# EAGLE design Adafruit Perma Proto Pi - Full Size (EAGLE 6.4)
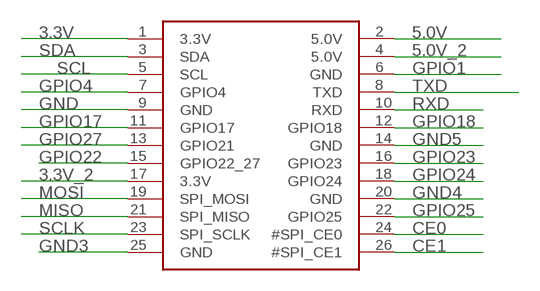
[diagram p0: schematic, sheet 1]

## Parts
JP1  RASBERRYPI_IDC  [RASBERRYPI_IDC]

## Nets
3.3V: JP1.1(3.3V)
3.3V_2: JP1.17(3.3V)
5.0V: JP1.2(5.0V)
5.0V_2: JP1.4(5.0V)
CE0: JP1.24(#SPI_CE0)
CE1: JP1.26(#SPI_CE1)
GND: JP1.9(GND)
GND3: JP1.25(GND)
GND4: JP1.20(GND)
GND5: JP1.14(GND)
GPIO1: JP1.6(GND)
GPIO4: JP1.7(GPIO4)
GPIO17: JP1.11(GPIO17)
GPIO18: JP1.12(GPIO18)
GPIO22: JP1.15(GPIO22_27)
GPIO23: JP1.16(GPIO23)
GPIO24: JP1.18(GPIO24)
GPIO25: JP1.22(GPIO25)
GPIO27: JP1.13(GPIO21)
MISO: JP1.21(SPI_MISO)
MOSI: JP1.19(SPI_MOSI)
RXD: JP1.10(RXD)
SCL: JP1.5(SCL)
SCLK: JP1.23(SPI_SCLK)
SDA: JP1.3(SDA)
TXD: JP1.8(TXD)

## Library data of the parts
JP1 = microbuilder:RASBERRYPI_IDC: Rasberry PI IDC Header

## Board
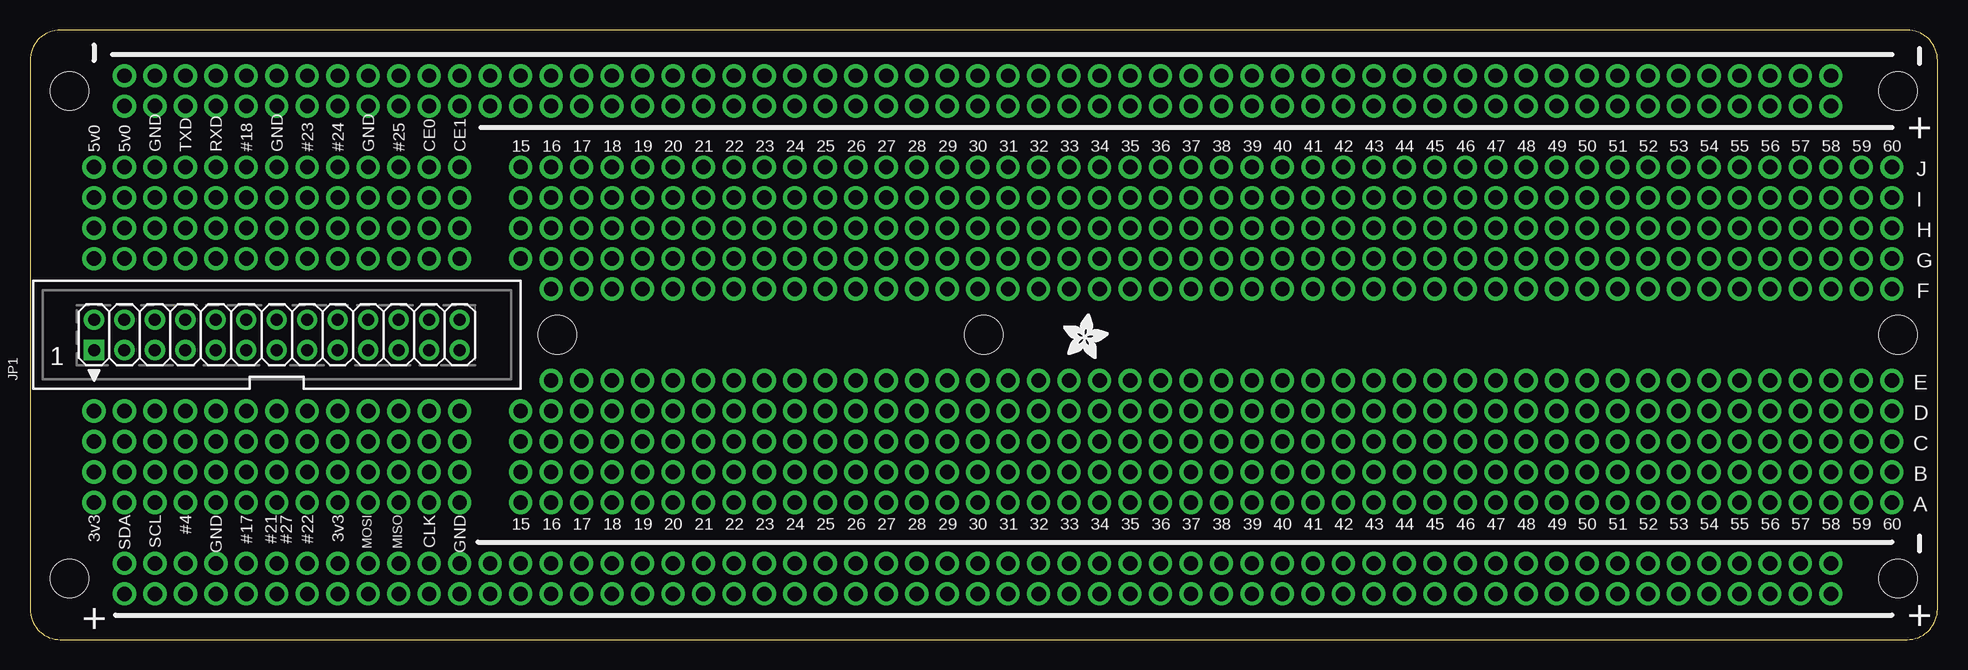
[diagram p1: board, top side]
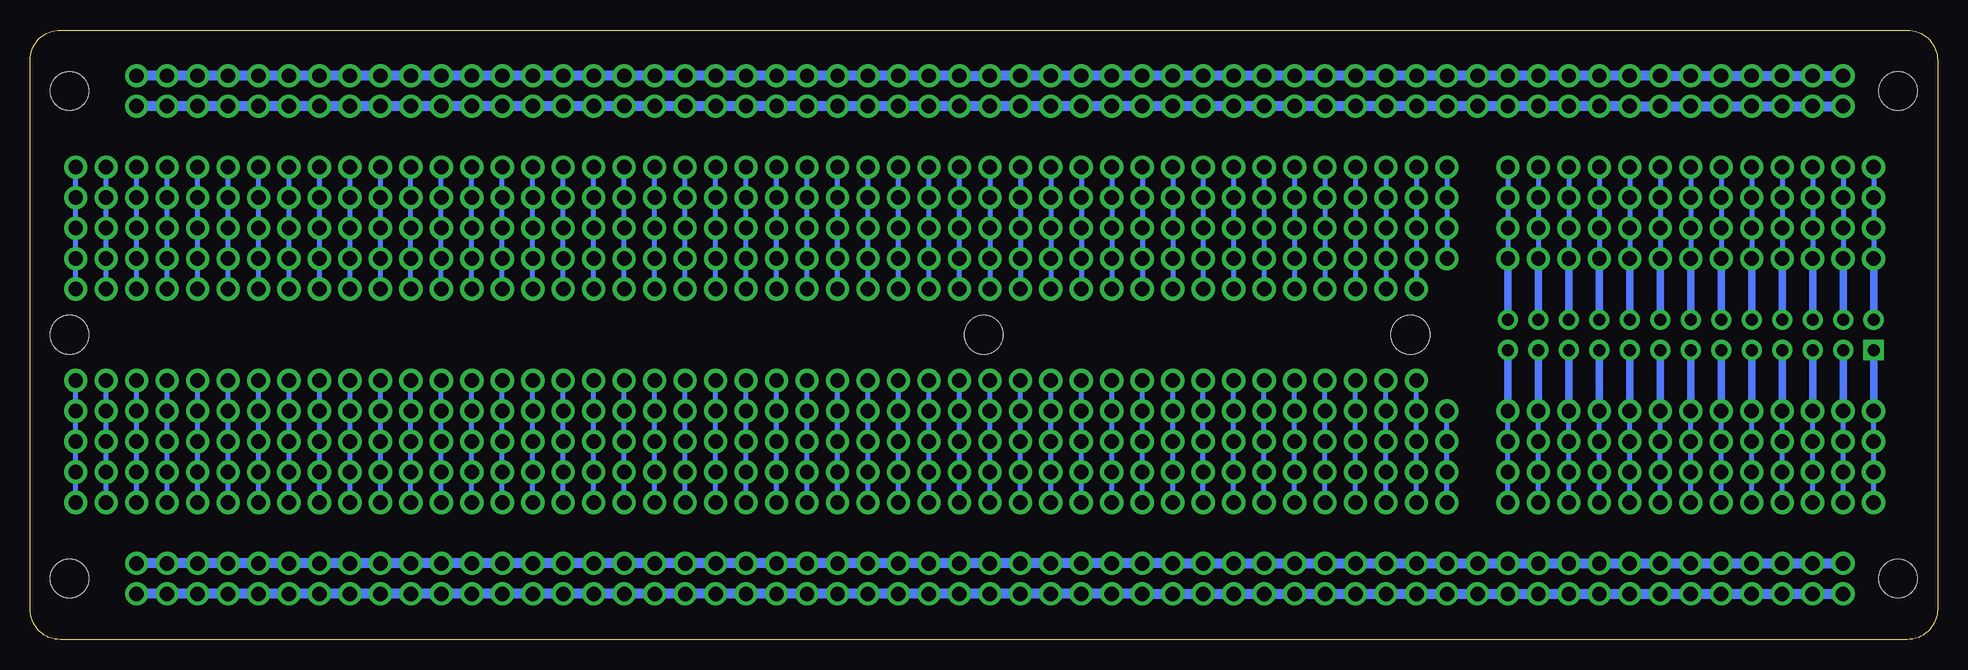
[diagram p2: board, bottom side, seen from below]

Size 159 x 50.8 mm. Coordinates in mm from the lower left corner, seen from the top.
Outline: 2.54,50.8 arc90 0,48.26 0,2.54 arc90 2.54,0 156.46,0 arc90 159,2.54 159,48.26 arc90 156.46,50.8 2.54,50.8
Copper layers (1*16): Top 0.035mm / dielectric 1.5mm / Bottom 0.035mm
Design rules "default": minimum track width 10mil, minimum drill 24mil, track to track 8mil, track to pad 8mil, pad to pad 8mil, via to via 8mil, smd to smd 8mil, copper to edge 40mil, drill to drill 8mil, minimum pad ring 10mil, minimum via ring 8mil, stop-mask expansion 4mil, vias tented up to drill 0mil, thermal gap 10mil
Holes 3.2 mm at 79.5,25.4 3.3,45.72 3.3,5.08 43.94,25.4 155.7,25.4 155.7,45.72 155.7,5.08

### Footprints (pad centres in the part's own frame; a part is rotated, then mirrored left to right if it is on the bottom)
RASBERRYPI_IDC = drill 1 pad 1.676 square: 1 -1.27,15.24 | drill 1 pad 1.676: 2 1.27,15.24; 3 -1.27,12.7; 4 1.27,12.7; 5 -1.27,10.16; 6 1.27,10.16; 7 -1.27,7.62; 8 1.27,7.62; 9 -1.27,5.08; 10 1.27,5.08; 11 -1.27,2.54; 12 1.27,2.54; 13 -1.27,0; 14 1.27,0; 15 -1.27,-2.54; 16 1.27,-2.54; 17 -1.27,-5.08; 18 1.27,-5.08; 19 -1.27,-7.62; 20 1.27,-7.62; 21 -1.27,-10.16; 22 1.27,-10.16; 23 -1.27,-12.7; 24 1.27,-12.7; 25 -1.27,-15.24; 26 1.27,-15.24

### Placement (x,y rotation side)
JP1  20.57,25.4 90 top
U$1  [ADAFRUIT_3.5MM]  86.11,23.37 0 top

### Tracks (layer width: path | path; a pad name or v marks a point on that pad's centre or on a via)
3.3V  (via drill 1.2 pad 1.93)
  Bottom 0.406: v5.33,19.05 v5.33,16.51 v5.33,13.97 v5.33,11.43
  Bottom 0.61: JP1.1 v5.33,19.05
3.3V_2  (via drill 1.2 pad 1.93)
  Bottom 0.406: v25.65,19.05 v25.65,16.51 v25.65,13.97 v25.65,11.43
  Bottom 0.61: v25.65,19.05 JP1.17
5.0V  (via drill 1.2 pad 1.93)
  Bottom 0.406: v5.33,39.37 v5.33,36.83 v5.33,34.29 v5.33,31.75
  Bottom 0.61: JP1.2 v5.33,31.75
5.0V_2  (via drill 1.2 pad 1.93)
  Bottom 0.406: v7.87,39.37 v7.87,36.83 v7.87,34.29 v7.87,31.75
  Bottom 0.61: JP1.4 v7.87,31.75
CE0  (via drill 1.2 pad 1.93)
  Bottom 0.406: v33.27,31.75 v33.27,34.29 v33.27,36.83 v33.27,39.37
  Bottom 0.61: JP1.24 v33.27,31.75
CE1  (via drill 1.2 pad 1.93)
  Bottom 0.406: v35.81,31.75 v35.81,34.29 v35.81,36.83 v35.81,39.37
  Bottom 0.61: v35.81,31.75 JP1.26
GND  (via drill 1.2 pad 1.93)
  Bottom 0.406: v15.49,19.05 v15.49,16.51 v15.49,13.97 v15.49,11.43
  Bottom 0.61: JP1.9 v15.49,19.05
GND3  (via drill 1.2 pad 1.93)
  Bottom 0.406: v35.81,19.05 v35.81,16.51 v35.81,13.97 v35.81,11.43
  Bottom 0.61: JP1.25 v35.81,19.05
GND4  (via drill 1.2 pad 1.93)
  Bottom 0.406: v28.19,31.75 v28.19,34.29 v28.19,36.83 v28.19,39.37
  Bottom 0.61: JP1.20 v28.19,31.75
GND5  (via drill 1.2 pad 1.93)
  Bottom 0.406: v20.57,39.37 v20.57,36.83 v20.57,34.29 v20.57,31.75
  Bottom 0.61: JP1.14 v20.57,31.75
GNDSTRIP1  (via drill 1.2 pad 1.93)
  Bottom 0.813: v7.87,46.99 v10.41,46.99 v12.95,46.99 v15.49,46.99 v18.03,46.99 v20.57,46.99 v23.11,46.99 v25.65,46.99 v28.19,46.99 v30.73,46.99 v33.27,46.99 v35.81,46.99 v38.35,46.99 v40.89,46.99 v43.43,46.99 v45.97,46.99 v48.51,46.99 v51.05,46.99 v53.59,46.99 v56.13,46.99 v58.67,46.99 v61.21,46.99 v63.75,46.99 v66.29,46.99 v68.83,46.99 v71.37,46.99 v73.91,46.99 v76.45,46.99 v78.99,46.99 v81.53,46.99 v84.07,46.99 v86.61,46.99 v89.15,46.99 v91.69,46.99 v94.23,46.99 v96.77,46.99 v99.31,46.99 v101.85,46.99 v104.39,46.99 v106.93,46.99 v109.47,46.99 v112.01,46.99 v114.55,46.99 v117.09,46.99 v119.63,46.99 v122.17,46.99 v124.71,46.99 v127.25,46.99 v129.79,46.99 v132.33,46.99 v134.87,46.99 v137.41,46.99 v139.95,46.99 v142.49,46.99 v145.03,46.99 v147.57,46.99 v150.11,46.99
GNDSTRIP2  (via drill 1.2 pad 1.93)
  Bottom 0.813: v7.87,6.35 v10.41,6.35 v12.95,6.35 v15.49,6.35 v18.03,6.35 v20.57,6.35 v23.11,6.35 v25.65,6.35 v28.19,6.35 v30.73,6.35 v33.27,6.35 v35.81,6.35 v38.35,6.35 v40.89,6.35 v43.43,6.35 v45.97,6.35 v48.51,6.35 v51.05,6.35 v53.59,6.35 v56.13,6.35 v58.67,6.35 v61.21,6.35 v63.75,6.35 v66.29,6.35 v68.83,6.35 v71.37,6.35 v73.91,6.35 v76.45,6.35 v78.99,6.35 v81.53,6.35 82.04,6.35 | 82.04,6.35 v84.07,6.35 v86.61,6.35 v89.15,6.35 v91.69,6.35 v94.23,6.35 v96.77,6.35 v99.31,6.35 v101.85,6.35 v104.39,6.35 v106.93,6.35 v109.47,6.35 v112.01,6.35 v114.55,6.35 v117.09,6.35 v119.63,6.35 v122.17,6.35 v124.71,6.35 v127.25,6.35 v129.79,6.35 v132.33,6.35 v134.87,6.35 v137.41,6.35 v139.95,6.35 v142.49,6.35 v145.03,6.35 v147.57,6.35 v150.11,6.35 | 82.04,6.35 82.04,6.1
GPIO1  (via drill 1.2 pad 1.93)
  Bottom 0.406: v10.41,31.75 v10.41,34.29 v10.41,36.83 v10.41,39.37
  Bottom 0.61: JP1.6 v10.41,31.75
GPIO4  (via drill 1.2 pad 1.93)
  Bottom 0.406: v12.95,11.43 v12.95,13.97 v12.95,16.51 v12.95,19.05
  Bottom 0.61: JP1.7 v12.95,19.05
GPIO17  (via drill 1.2 pad 1.93)
  Bottom 0.406: v18.03,11.43 v18.03,13.97 v18.03,16.51 v18.03,19.05
  Bottom 0.61: JP1.11 v18.03,19.05
GPIO18  (via drill 1.2 pad 1.93)
  Bottom 0.406: v18.03,31.75 v18.03,34.29 v18.03,36.83 v18.03,39.37
  Bottom 0.61: JP1.12 v18.03,31.75
GPIO22  (via drill 1.2 pad 1.93)
  Bottom 0.406: v23.11,11.43 v23.11,13.97 v23.11,16.51 v23.11,19.05
  Bottom 0.61: JP1.15 v23.11,19.05
GPIO23  (via drill 1.2 pad 1.93)
  Bottom 0.406: v23.11,31.75 v23.11,34.29 v23.11,36.83 v23.11,39.37
  Bottom 0.61: JP1.16 v23.11,31.75
GPIO24  (via drill 1.2 pad 1.93)
  Bottom 0.406: v25.65,39.37 v25.65,36.83 v25.65,34.29 v25.65,31.75
  Bottom 0.61: JP1.18 v25.65,31.75
GPIO25  (via drill 1.2 pad 1.93)
  Bottom 0.406: v30.73,39.37 v30.73,36.83 v30.73,34.29 v30.73,31.75
  Bottom 0.61: v30.73,31.75 JP1.22
GPIO27  (via drill 1.2 pad 1.93)
  Bottom 0.406: v20.57,19.05 v20.57,16.51 v20.57,13.97 v20.57,11.43
  Bottom 0.61: JP1.13 v20.57,19.05
MISO  (via drill 1.2 pad 1.93)
  Bottom 0.406: v30.73,19.05 v30.73,16.51 v30.73,13.97 v30.73,11.43
  Bottom 0.61: v30.73,19.05 JP1.21
MOSI  (via drill 1.2 pad 1.93)
  Bottom 0.406: v28.19,19.05 v28.19,16.51 v28.19,13.97 v28.19,11.43
  Bottom 0.61: JP1.19 v28.19,19.05
N$15  (via drill 1.2 pad 1.93)
  Bottom 0.406: v40.89,11.43 v40.89,13.97 v40.89,16.51 v40.89,19.05
N$16  (via drill 1.2 pad 1.93)
  Bottom 0.406: v43.43,21.59 v43.43,19.05 v43.43,16.51 v43.43,13.97 v43.43,11.43
N$17  (via drill 1.2 pad 1.93)
  Bottom 0.406: v48.51,21.59 v48.51,19.05 v48.51,16.51 v48.51,13.97 v48.51,11.43
N$18  (via drill 1.2 pad 1.93)
  Bottom 0.406: v45.97,11.43 v45.97,13.97 v45.97,16.51 v45.97,19.05 v45.97,21.59
N$19  (via drill 1.2 pad 1.93)
  Bottom 0.406: v51.05,21.59 v51.05,19.05 v51.05,16.51 v51.05,13.97 v51.05,11.43
N$20  (via drill 1.2 pad 1.93)
  Bottom 0.406: v53.59,11.43 v53.59,13.97 v53.59,16.51 v53.59,19.05 v53.59,21.59
N$21  (via drill 1.2 pad 1.93)
  Bottom 0.406: v58.67,11.43 v58.67,13.97 v58.67,16.51 v58.67,19.05 v58.67,21.59
N$22  (via drill 1.2 pad 1.93)
  Bottom 0.406: v56.13,21.59 v56.13,19.05 v56.13,16.51 v56.13,13.97 v56.13,11.43
N$23  (via drill 1.2 pad 1.93)
  Bottom 0.406: v61.21,21.59 v61.21,19.05 v61.21,16.51 v61.21,13.97 v61.21,11.43
N$24  (via drill 1.2 pad 1.93)
  Bottom 0.406: v63.75,11.43 v63.75,13.97 v63.75,16.51 v63.75,19.05 v63.75,21.59
N$25  (via drill 1.2 pad 1.93)
  Bottom 0.406: v66.29,21.59 v66.29,19.05 v66.29,16.51 v66.29,13.97 v66.29,11.43
N$26  (via drill 1.2 pad 1.93)
  Bottom 0.406: v68.83,11.43 v68.83,13.97 v68.83,16.51 v68.83,19.05 v68.83,21.59
N$27  (via drill 1.2 pad 1.93)
  Bottom 0.406: v73.91,21.59 v73.91,19.05 v73.91,16.51 v73.91,13.97 v73.91,11.43
N$28  (via drill 1.2 pad 1.93)
  Bottom 0.406: v71.37,11.43 v71.37,13.97 v71.37,16.51 v71.37,19.05 v71.37,21.59
N$29  (via drill 1.2 pad 1.93)
  Bottom 0.406: v76.45,21.59 v76.45,19.05 v76.45,16.51 v76.45,13.97 v76.45,11.43
N$30  (via drill 1.2 pad 1.93)
  Bottom 0.406: v78.99,11.43 v78.99,13.97 v78.99,16.51 v78.99,19.05 v78.99,21.59
N$33  (via drill 1.2 pad 1.93)
  Bottom 0.406: v78.99,29.21 v78.99,31.75 v78.99,34.29 v78.99,36.83 v78.99,39.37
N$34  (via drill 1.2 pad 1.93)
  Bottom 0.406: v76.45,39.37 v76.45,36.83 v76.45,34.29 v76.45,31.75 v76.45,29.21
N$35  (via drill 1.2 pad 1.93)
  Bottom 0.406: v73.91,29.21 v73.91,31.75 v73.91,34.29 v73.91,36.83 v73.91,39.37
N$36  (via drill 1.2 pad 1.93)
  Bottom 0.406: v71.37,39.37 v71.37,36.83 v71.37,34.29 v71.37,31.75 v71.37,29.21
N$37  (via drill 1.2 pad 1.93)
  Bottom 0.406: v68.83,29.21 v68.83,31.75 v68.83,34.29 v68.83,36.83 v68.83,39.37
N$38  (via drill 1.2 pad 1.93)
  Bottom 0.406: v66.29,39.37 v66.29,36.83 v66.29,34.29 v66.29,31.75 v66.29,29.21
N$39  (via drill 1.2 pad 1.93)
  Bottom 0.406: v61.21,39.37 v61.21,36.83 v61.21,34.29 v61.21,31.75 v61.21,29.21
N$40  (via drill 1.2 pad 1.93)
  Bottom 0.406: v63.75,29.21 v63.75,31.75 v63.75,34.29 v63.75,36.83 v63.75,39.37
N$41  (via drill 1.2 pad 1.93)
  Bottom 0.406: v58.67,29.21 v58.67,31.75 v58.67,34.29 v58.67,36.83 v58.67,39.37
N$42  (via drill 1.2 pad 1.93)
  Bottom 0.406: v56.13,29.21 v56.13,31.75 v56.13,34.29 v56.13,36.83 v56.13,39.37
N$43  (via drill 1.2 pad 1.93)
  Bottom 0.406: v53.59,29.21 v53.59,31.75 v53.59,34.29 v53.59,36.83 v53.59,39.37
N$44  (via drill 1.2 pad 1.93)
  Bottom 0.406: v51.05,39.37 v51.05,36.83 v51.05,34.29 v51.05,31.75 v51.05,29.21
N$45  (via drill 1.2 pad 1.93)
  Bottom 0.406: v48.51,29.21 v48.51,31.75 v48.51,34.29 v48.51,36.83 v48.51,39.37
N$46  (via drill 1.2 pad 1.93)
  Bottom 0.406: v45.97,39.37 v45.97,36.83 v45.97,34.29 v45.97,31.75 v45.97,29.21
N$47  (via drill 1.2 pad 1.93)
  Bottom 0.406: v43.43,39.37 v43.43,36.83 v43.43,34.29 v43.43,31.75 v43.43,29.21
N$48  (via drill 1.2 pad 1.93)
  Bottom 0.406: v40.89,31.75 v40.89,34.29 v40.89,36.83 v40.89,39.37
N$103  (via drill 1.2 pad 1.93)
  Bottom 0.406: v81.53,21.59 v81.53,19.05 v81.53,16.51 v81.53,13.97 v81.53,11.43
N$104  (via drill 1.2 pad 1.93)
  Bottom 0.406: v84.07,11.43 v84.07,13.97 v84.07,16.51 v84.07,19.05 v84.07,21.59
N$105  (via drill 1.2 pad 1.93)
  Bottom 0.406: v86.61,21.59 v86.61,19.05 v86.61,16.51 v86.61,13.97 v86.61,11.43
N$106  (via drill 1.2 pad 1.93)
  Bottom 0.406: v89.15,11.43 v89.15,13.97 v89.15,16.51 v89.15,19.05 v89.15,21.59
N$107  (via drill 1.2 pad 1.93)
  Bottom 0.406: v91.69,21.59 v91.69,19.05 v91.69,16.51 v91.69,13.97 v91.69,11.43
N$108  (via drill 1.2 pad 1.93)
  Bottom 0.406: v94.23,11.43 v94.23,13.97 v94.23,16.51 v94.23,19.05 v94.23,21.59
N$109  (via drill 1.2 pad 1.93)
  Bottom 0.406: v99.31,11.43 v99.31,13.97 v99.31,16.51 v99.31,19.05 v99.31,21.59
N$110  (via drill 1.2 pad 1.93)
  Bottom 0.406: v96.77,21.59 v96.77,19.05 v96.77,16.51 v96.77,13.97 v96.77,11.43
N$111  (via drill 1.2 pad 1.93)
  Bottom 0.406: v101.85,21.59 v101.85,19.05 v101.85,16.51 v101.85,13.97 v101.85,11.43
N$112  (via drill 1.2 pad 1.93)
  Bottom 0.406: v104.39,21.59 v104.39,19.05 v104.39,16.51 v104.39,13.97 v104.39,11.43
N$113  (via drill 1.2 pad 1.93)
  Bottom 0.406: v106.93,21.59 v106.93,19.05 v106.93,16.51 v106.93,13.97 v106.93,11.43
N$114  (via drill 1.2 pad 1.93)
  Bottom 0.406: v109.47,11.43 v109.47,13.97 v109.47,16.51 v109.47,19.05 v109.47,21.59
N$115  (via drill 1.2 pad 1.93)
  Bottom 0.406: v112.01,21.59 v112.01,19.05 v112.01,16.51 v112.01,13.97 v112.01,11.43
N$116  (via drill 1.2 pad 1.93)
  Bottom 0.406: v114.55,11.43 v114.55,13.97 v114.55,16.51 v114.55,19.05 v114.55,21.59
N$117  (via drill 1.2 pad 1.93)
  Bottom 0.406: v117.09,11.43 v117.09,13.97 v117.09,16.51 v117.09,19.05 v117.09,21.59
N$118  (via drill 1.2 pad 1.93)
  Bottom 0.406: v119.63,21.59 v119.63,19.05 v119.63,16.51 v119.63,13.97 v119.63,11.43
N$119  (via drill 1.2 pad 1.93)
  Bottom 0.406: v124.71,21.59 v124.71,19.05 v124.71,16.51 v124.71,13.97 v124.71,11.43
N$120  (via drill 1.2 pad 1.93)
  Bottom 0.406: v122.17,11.43 v122.17,13.97 v122.17,16.51 v122.17,19.05 v122.17,21.59
N$121  (via drill 1.2 pad 1.93)
  Bottom 0.406: v127.25,21.59 v127.25,19.05 v127.25,16.51 v127.25,13.97 v127.25,11.43
N$122  (via drill 1.2 pad 1.93)
  Bottom 0.406: v129.79,11.43 v129.79,13.97 v129.79,16.51 v129.79,19.05 v129.79,21.59
N$123  (via drill 1.2 pad 1.93)
  Bottom 0.406: v134.87,11.43 v134.87,13.97 v134.87,16.51 v134.87,19.05 v134.87,21.59
N$124  (via drill 1.2 pad 1.93)
  Bottom 0.406: v132.33,21.59 v132.33,19.05 v132.33,16.51 v132.33,13.97 v132.33,11.43
N$125  (via drill 1.2 pad 1.93)
  Bottom 0.406: v137.41,21.59 v137.41,19.05 v137.41,16.51 v137.41,13.97 v137.41,11.43
N$126  (via drill 1.2 pad 1.93)
  Bottom 0.406: v139.95,11.43 v139.95,13.97 v139.95,16.51 v139.95,19.05 v139.95,21.59
N$127  (via drill 1.2 pad 1.93)
  Bottom 0.406: v142.49,21.59 v142.49,19.05 v142.49,16.51 v142.49,13.97 v142.49,11.43
N$128  (via drill 1.2 pad 1.93)
  Bottom 0.406: v145.03,11.43 v145.03,13.97 v145.03,16.51 v145.03,19.05 v145.03,21.59
N$129  (via drill 1.2 pad 1.93)
  Bottom 0.406: v150.11,21.59 v150.11,19.05 v150.11,16.51 v150.11,13.97 v150.11,11.43
N$130  (via drill 1.2 pad 1.93)
  Bottom 0.406: v147.57,11.43 v147.57,13.97 v147.57,16.51 v147.57,19.05 v147.57,21.59
N$131  (via drill 1.2 pad 1.93)
  Bottom 0.406: v152.65,21.59 v152.65,19.05 v152.65,16.51 v152.65,13.97 v152.65,11.43
N$132  (via drill 1.2 pad 1.93)
  Bottom 0.406: v155.19,11.43 v155.19,13.97 v155.19,16.51 v155.19,19.05 v155.19,21.59
N$133  (via drill 1.2 pad 1.93)
  Bottom 0.406: v155.19,29.21 v155.19,31.75 v155.19,34.29 v155.19,36.83 v155.19,39.37
N$134  (via drill 1.2 pad 1.93)
  Bottom 0.406: v152.65,39.37 v152.65,36.83 v152.65,34.29 v152.65,31.75 v152.65,29.21
N$135  (via drill 1.2 pad 1.93)
  Bottom 0.406: v150.11,29.21 v150.11,31.75 v150.11,34.29 v150.11,36.83 v150.11,39.37
N$136  (via drill 1.2 pad 1.93)
  Bottom 0.406: v147.57,39.37 v147.57,36.83 v147.57,34.29 v147.57,31.75 v147.57,29.21
N$137  (via drill 1.2 pad 1.93)
  Bottom 0.406: v145.03,29.21 v145.03,31.75 v145.03,34.29 v145.03,36.83 v145.03,39.37
N$138  (via drill 1.2 pad 1.93)
  Bottom 0.406: v142.49,39.37 v142.49,36.83 v142.49,34.29 v142.49,31.75 v142.49,29.21
N$139  (via drill 1.2 pad 1.93)
  Bottom 0.406: v137.41,39.37 v137.41,36.83 v137.41,34.29 v137.41,31.75 v137.41,29.21
N$140  (via drill 1.2 pad 1.93)
  Bottom 0.406: v139.95,29.21 v139.95,31.75 v139.95,34.29 v139.95,36.83 v139.95,39.37
N$141  (via drill 1.2 pad 1.93)
  Bottom 0.406: v134.87,29.21 v134.87,31.75 v134.87,34.29 v134.87,36.83 v134.87,39.37
N$142  (via drill 1.2 pad 1.93)
  Bottom 0.406: v132.33,29.21 v132.33,31.75 v132.33,34.29 v132.33,36.83 v132.33,39.37
N$143  (via drill 1.2 pad 1.93)
  Bottom 0.406: v129.79,29.21 v129.79,31.75 v129.79,34.29 v129.79,36.83 v129.79,39.37
N$144  (via drill 1.2 pad 1.93)
  Bottom 0.406: v127.25,39.37 v127.25,36.83 v127.25,34.29 v127.25,31.75 v127.25,29.21
N$145  (via drill 1.2 pad 1.93)
  Bottom 0.406: v124.71,29.21 v124.71,31.75 v124.71,34.29 v124.71,36.83 v124.71,39.37
N$146  (via drill 1.2 pad 1.93)
  Bottom 0.406: v122.17,39.37 v122.17,36.83 v122.17,34.29 v122.17,31.75 v122.17,29.21
N$147  (via drill 1.2 pad 1.93)
  Bottom 0.406: v119.63,39.37 v119.63,36.83 v119.63,34.29 v119.63,31.75 v119.63,29.21
N$148  (via drill 1.2 pad 1.93)
  Bottom 0.406: v117.09,29.21 v117.09,31.75 v117.09,34.29 v117.09,36.83 v117.09,39.37
N$149  (via drill 1.2 pad 1.93)
  Bottom 0.406: v112.01,29.21 v112.01,31.75 v112.01,34.29 v112.01,36.83 v112.01,39.37
N$150  (via drill 1.2 pad 1.93)
  Bottom 0.406: v114.55,39.37 v114.55,36.83 v114.55,34.29 v114.55,31.75 v114.55,29.21
N$151  (via drill 1.2 pad 1.93)
  Bottom 0.406: v109.47,29.21 v109.47,31.75 v109.47,34.29 v109.47,36.83 v109.47,39.37
N$152  (via drill 1.2 pad 1.93)
  Bottom 0.406: v106.93,39.37 v106.93,36.83 v106.93,34.29 v106.93,31.75 v106.93,29.21
N$153  (via drill 1.2 pad 1.93)
  Bottom 0.406: v101.85,39.37 v101.85,36.83 v101.85,34.29 v101.85,31.75 v101.85,29.21
N$154  (via drill 1.2 pad 1.93)
  Bottom 0.406: v104.39,29.21 v104.39,31.75 v104.39,34.29 v104.39,36.83 v104.39,39.37
N$155  (via drill 1.2 pad 1.93)
  Bottom 0.406: v99.31,29.21 v99.31,31.75 v99.31,34.29 v99.31,36.83 v99.31,39.37
N$156  (via drill 1.2 pad 1.93)
  Bottom 0.406: v96.77,39.37 v96.77,36.83 v96.77,34.29 v96.77,31.75 v96.77,29.21
N$157  (via drill 1.2 pad 1.93)
  Bottom 0.406: v94.23,29.21 v94.23,31.75 v94.23,34.29 v94.23,36.83 v94.23,39.37
N$158  (via drill 1.2 pad 1.93)
  Bottom 0.406: v91.69,39.37 v91.69,36.83 v91.69,34.29 v91.69,31.75 v91.69,29.21
N$159  (via drill 1.2 pad 1.93)
  Bottom 0.406: v86.61,29.21 v86.61,31.75 v86.61,34.29 v86.61,36.83 v86.61,39.37
N$160  (via drill 1.2 pad 1.93)
  Bottom 0.406: v89.15,39.37 v89.15,36.83 v89.15,34.29 v89.15,31.75 v89.15,29.21
N$161  (via drill 1.2 pad 1.93)
  Bottom 0.406: v84.07,29.21 v84.07,31.75 v84.07,34.29 v84.07,36.83 v84.07,39.37
N$162  (via drill 1.2 pad 1.93)
  Bottom 0.406: v81.53,39.37 v81.53,36.83 v81.53,34.29 v81.53,31.75 v81.53,29.21
PWRSTRIP1  (via drill 1.2 pad 1.93)
  Bottom 0.813: v7.87,44.45 v10.41,44.45 v12.95,44.45 v15.49,44.45 v18.03,44.45 v20.57,44.45 v23.11,44.45 v25.65,44.45 v28.19,44.45 v30.73,44.45 v33.27,44.45 v35.81,44.45 v38.35,44.45 v40.89,44.45 v43.43,44.45 v45.97,44.45 v48.51,44.45 v51.05,44.45 v53.59,44.45 v56.13,44.45 v58.67,44.45 v61.21,44.45 v63.75,44.45 v66.29,44.45 v68.83,44.45 v71.37,44.45 v73.91,44.45 v76.45,44.45 v78.99,44.45 v81.53,44.45 v84.07,44.45 v86.61,44.45 v89.15,44.45 v91.69,44.45 v94.23,44.45 v96.77,44.45 v99.31,44.45 v101.85,44.45 v104.39,44.45 v106.93,44.45 v109.47,44.45 v112.01,44.45 v114.55,44.45 v117.09,44.45 v119.63,44.45 v122.17,44.45 v124.71,44.45 v127.25,44.45 v129.79,44.45 v132.33,44.45 v134.87,44.45 v137.41,44.45 v139.95,44.45 v142.49,44.45 v145.03,44.45 v147.57,44.45 v150.11,44.45
PWRSTRIP2  (via drill 1.2 pad 1.93)
  Bottom 0.813: v7.87,3.81 v10.41,3.81 v12.95,3.81 v15.49,3.81 v18.03,3.81 v20.57,3.81 v23.11,3.81 v25.65,3.81 v28.19,3.81 v30.73,3.81 v33.27,3.81 v35.81,3.81 v38.35,3.81 v40.89,3.81 v43.43,3.81 v45.97,3.81 v48.51,3.81 v51.05,3.81 v53.59,3.81 v56.13,3.81 v58.67,3.81 v61.21,3.81 v63.75,3.81 v66.29,3.81 v68.83,3.81 v71.37,3.81 v73.91,3.81 v76.45,3.81 v78.99,3.81 81.28,3.81 | v150.11,3.81 v147.57,3.81 v145.03,3.81 v142.49,3.81 v139.95,3.81 v137.41,3.81 v134.87,3.81 v132.33,3.81 v129.79,3.81 v127.25,3.81 v124.71,3.81 v122.17,3.81 v119.63,3.81 v117.09,3.81 v114.55,3.81 v112.01,3.81 v109.47,3.81 v106.93,3.81 v104.39,3.81 v101.85,3.81 v99.31,3.81 v96.77,3.81 v94.23,3.81 v91.69,3.81 v89.15,3.81 v86.61,3.81 v84.07,3.81 v81.53,3.81 81.28,3.81 | 81.28,3.81 81.28,3.56
RXD  (via drill 1.2 pad 1.93)
  Bottom 0.406: v15.49,39.37 v15.49,36.83 v15.49,34.29 v15.49,31.75
  Bottom 0.61: JP1.10 v15.49,31.75
SCL  (via drill 1.2 pad 1.93)
  Bottom 0.406: v10.41,19.05 v10.41,16.51 v10.41,13.97 v10.41,11.43
  Bottom 0.61: JP1.5 v10.41,19.05
SCLK  (via drill 1.2 pad 1.93)
  Bottom 0.406: v33.27,11.43 v33.27,13.97 v33.27,16.51 v33.27,19.05
  Bottom 0.61: v33.27,19.05 JP1.23
SDA  (via drill 1.2 pad 1.93)
  Bottom 0.406: v7.87,11.43 v7.87,13.97 v7.87,16.51 v7.87,19.05
  Bottom 0.61: JP1.3 v7.87,19.05
TXD  (via drill 1.2 pad 1.93)
  Bottom 0.406: v12.95,39.37 v12.95,36.83 v12.95,34.29 v12.95,31.75
  Bottom 0.61: JP1.8 v12.95,31.75

### Text on the board
tPlace: 5v0 | 5v0 | GND | TXD | RXD | #18 | GND | #23 | #24 | GND | #25 | CE0 | CE1 | 15 | 16 | 17 | 18 | 19 | 20 | 21 | 22 | 23 | 24 | 25 | 26 | 27 | 28 | 29 | 30 | 31 | 32 | 33 | 34 | 35 | 36 | 37 | 38 | 39 | 40 | 41 | 42 | 43 | 44 | 45 | 46 | 47 | 48 | 49 | 50 | 51 | 52 | 53 | 54 | 55 | 56 | 57 | 58 | 59 | 60 | J | I | H | G | F | E | D | C | B | 3v3 | SDA | SCL | #4 | GND | #17 | #21 | #27 | #22 | 3v3 | MOSI | MISO | CLK | GND | A | 15 | 16 | 17 | 18 | 19 | 20 | 21 | 22 | 23 | 24 | 25 | 26 | 27 | 28 | 29 | 30 | 31 | 32 | 33 | 34 | 35 | 36 | 37 | 38 | 39 | 40 | 41 | 42 | 43 | 44 | 45 | 46 | 47 | 48 | 49 | 50 | 51 | 52 | 53 | 54 | 55 | 56 | 57 | 58 | 59 | 60
tDocu: Full-size Breadboard | Adafruit PermaProto for Raspberry Pi
tPlaceRed: + | + | +